# Altium schematic sheet MOSFET.SchDoc
size A4
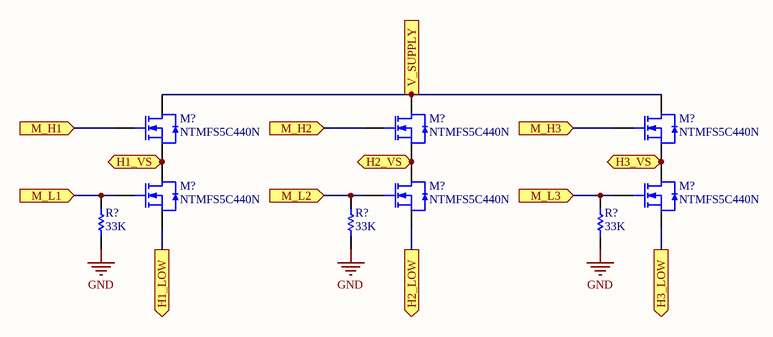
[diagram p0: MOSFET.SchDoc]

## Parts
(Parts that share a designator on the sheet are numbered #1, #2 ... from top to bottom, then left to right.)
M?#1  NTMFS5C440N  [PSON127P620X100-8N]
M?#2  NTMFS5C440N  [PSON127P620X100-8N]
M?#3  NTMFS5C440N  [PSON127P620X100-8N]
M?#4  NTMFS5C440N  [PSON127P620X100-8N]
M?#5  NTMFS5C440N  [PSON127P620X100-8N]
M?#6  NTMFS5C440N  [PSON127P620X100-8N]
R?#1  33K  [SMR_0402]
R?#2  33K  [SMR_0402]
R?#3  33K  [SMR_0402]

## Ports
H1_LOW (out), H1_VS (bidir), H2_LOW (out), H2_VS (bidir), H3_LOW (out), H3_VS (bidir), M_H1 (in), M_H2 (in), M_H3 (in), M_L1 (in), M_L2 (in), M_L3 (in), V_SUPPLY (in)

## Nets
GND: R?#1.1 R?#2.1 R?#3.1
H1_LOW: M?#4.S ; port H1_LOW
H1_VS: M?#1.S M?#4.D ; port H1_VS
H2_LOW: M?#5.S ; port H2_LOW
H2_VS: M?#2.S M?#5.D ; port H2_VS
H3_LOW: M?#6.S ; port H3_LOW
H3_VS: M?#3.S M?#6.D ; port H3_VS
M_H1: M?#1.G ; port M_H1
M_H2: M?#2.G ; port M_H2
M_H3: M?#3.G ; port M_H3
M_L1: M?#4.G R?#1.2 ; port M_L1
M_L2: M?#5.G R?#2.2 ; port M_L2
M_L3: M?#6.G R?#3.2 ; port M_L3
V_SUPPLY: M?#1.D M?#2.D M?#3.D ; port V_SUPPLY

## Library data of the parts
R?#1-R?#3 = Res SMT